# EAGLE design Power_Block (EAGLE 5.06)
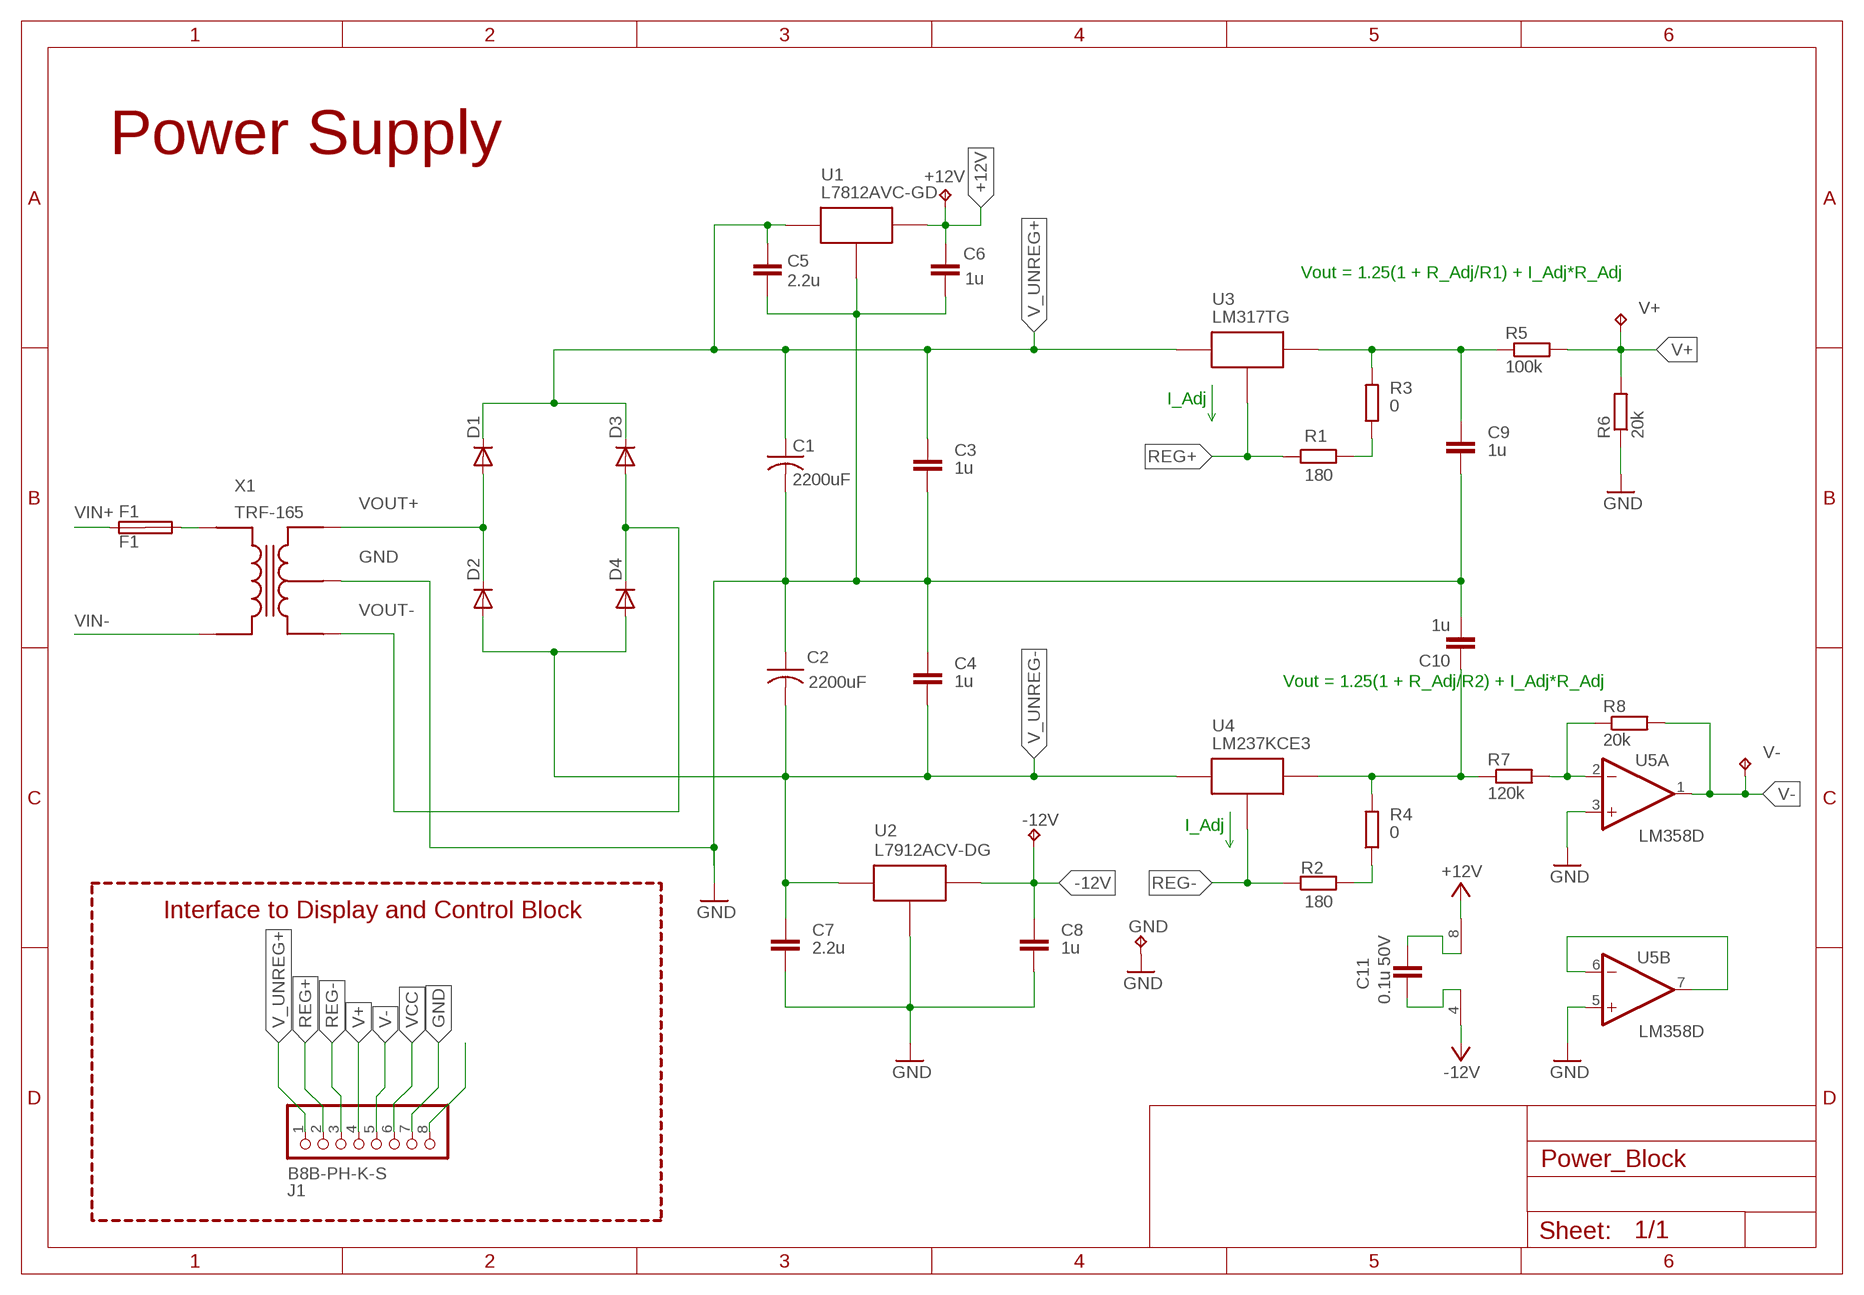
[diagram p0: schematic, sheet 1]

## Parts
+12V  TPTP20SQ  [TP20SQ]
-12V  TPTP20SQ  [TP20SQ]
C1  2200uF  ESK228M  [ESK228M]
C2  2200uF  ESK228M  [ESK228M]
C3  1u  C-EU025-024X044  [C025-024X044]
C4  1u  C-EU025-024X044  [C025-024X044]
C5  2.2u  C-EU025-024X044  [C025-024X044]
C6  1u  C-EU025-024X044  [C025-024X044]
C7  2.2u  C-EU025-024X044  [C025-024X044]
C8  1u  C-EU025-024X044  [C025-024X044]
C9  1u  C-EU025-024X044  [C025-024X044]
C10  1u  C-EU025-024X044  [C025-024X044]
C11  0.1u 50V  C-EU025-024X044  [C025-024X044]
D1  VS-2EFH02HM3/I  [DO-219AB]
D2  VS-2EFH02HM3/I  [DO-219AB]
D3  VS-2EFH02HM3/I  [DO-219AB]
D4  VS-2EFH02HM3/I  [DO-219AB]
F1  F1  SHK20L  [SHK20L]
GND  TPTP20SQ  [TP20SQ]
J1  B8B-PH-K-S  [B8B-PH-K-S]
R1  180  R-EU_R0603  [R0603]
R2  180  R-EU_R0603  [R0603]
R3  0  R-EU_R0603  [R0603]
R4  0  R-EU_R0603  [R0603]
R5  100k  R-EU_R0603  [R0603]
R6  20k  R-EU_R0603  [R0603]
R7  120k  R-EU_R0603  [R0603]
R8  20k  R-EU_R0603  [R0603]
U1  L7812AVC-GD  [T0-220]
U2  L7912ACV-DG  [T0-220]
U3  LM317TG  [T0-220]
U4  LM237KCE3  [T0-220]
U5  LM358D  [SO08]
V+  TPTP20SQ  [TP20SQ]
V-  TPTP20SQ  [TP20SQ]
X1  TRF-165  [TRF-165]

## Nets
+12V: +12V.TP C6.2 C11.2 U1.P3 U5.8(P:V+) ; supply symbol labelled VCC
-12V: -12V.TP C8.2 C11.1 U2.P3 U5.4(P:V-) ; supply symbol labelled VCC
GND: C1.LL- C2.LL+ C3.1 C4.2 C5.1 C6.1 C7.1 C8.1 C9.1 C10.2 GND.TP J1.7 R6.1 U1.P2 U2.P1 U5.3(A:+IN) U5.5(B:+IN) X1.GND
N$5: U5.6(B:-IN) U5.7(B:OUT)
N$8: C10.1 R4.2 R7.1 U4.P3
N$11: J1.8
N$15: R2.2 R4.1
N$16: R7.2 R8.1 U5.2(A:-IN)
N$17: R1.2 R3.1
N$20: F1.2A X1.VIN1
REG+: J1.2 R1.1 U3.P1
REG-: J1.3 R2.1 U4.P1
V+: J1.4 R5.2 R6.2 V+.TP
V-: J1.5 R8.2 U5.1(A:OUT) V-.TP
V_POS_REG: C9.2 R3.2 R5.1 U3.P2
V_UNREG+: C1.LL+ C3.2 C5.2 D1.C D3.C J1.1 U1.P1 U3.P3
V_UNREG-: C2.LL- C4.1 C7.2 D2.A D4.A U2.P2 U4.P2
VCC: J1.6
VIN+: F1.1A
VIN-: X1.VIN2
VOUT+: D1.A D2.C X1.VOUT+
VOUT-: D3.A D4.C X1.VOUT-
Unconnected: F1.1B F1.2B

## Notes on the sheet
- Power Supply
- Vout = 1.25(1 + R_Adj/R1) + I_Adj*R_Adj
- I_Adj
- Vout = 1.25(1 + R_Adj/R2) + I_Adj*R_Adj
- I_Adj
- Interface to Display and Control Block

## Library data of the parts
+12V -12V GND V+ V- = testpad:TP: Test pad
C1 C2 = VladimirG:ESK228M
C3-C11 = rcl:C-EU: CAPACITOR, European symbol
D1-D4 = VladimirG:VS-2EFH02HM3/I
F1 = fuse:SHK20L: FUSE HOLDER 5 x 20 mm, SH contact, SHH1 Schukat, E1073 Buerklin
J1 = VladimirG:B8B-PH-K-S: CONN HEADER VERT 8POS 2MM
R1-R8 = rcl:R-EU_: RESISTOR, European symbol
U1 = VladimirG:L7812AVC-GD: IC REG LINEAR 12V 1.5A TO220AB
U2 = VladimirG:L7912ACV-DG
U3 = VladimirG:LM317TG
U4 = VladimirG:LM237KCE3
U5 = linear:LM358: OP AMP also LM158; LM258; LM2904 Source: http://cache.national.com/ds/LM/LM158.pdf
X1 = VladimirG:TRF-165

## Board
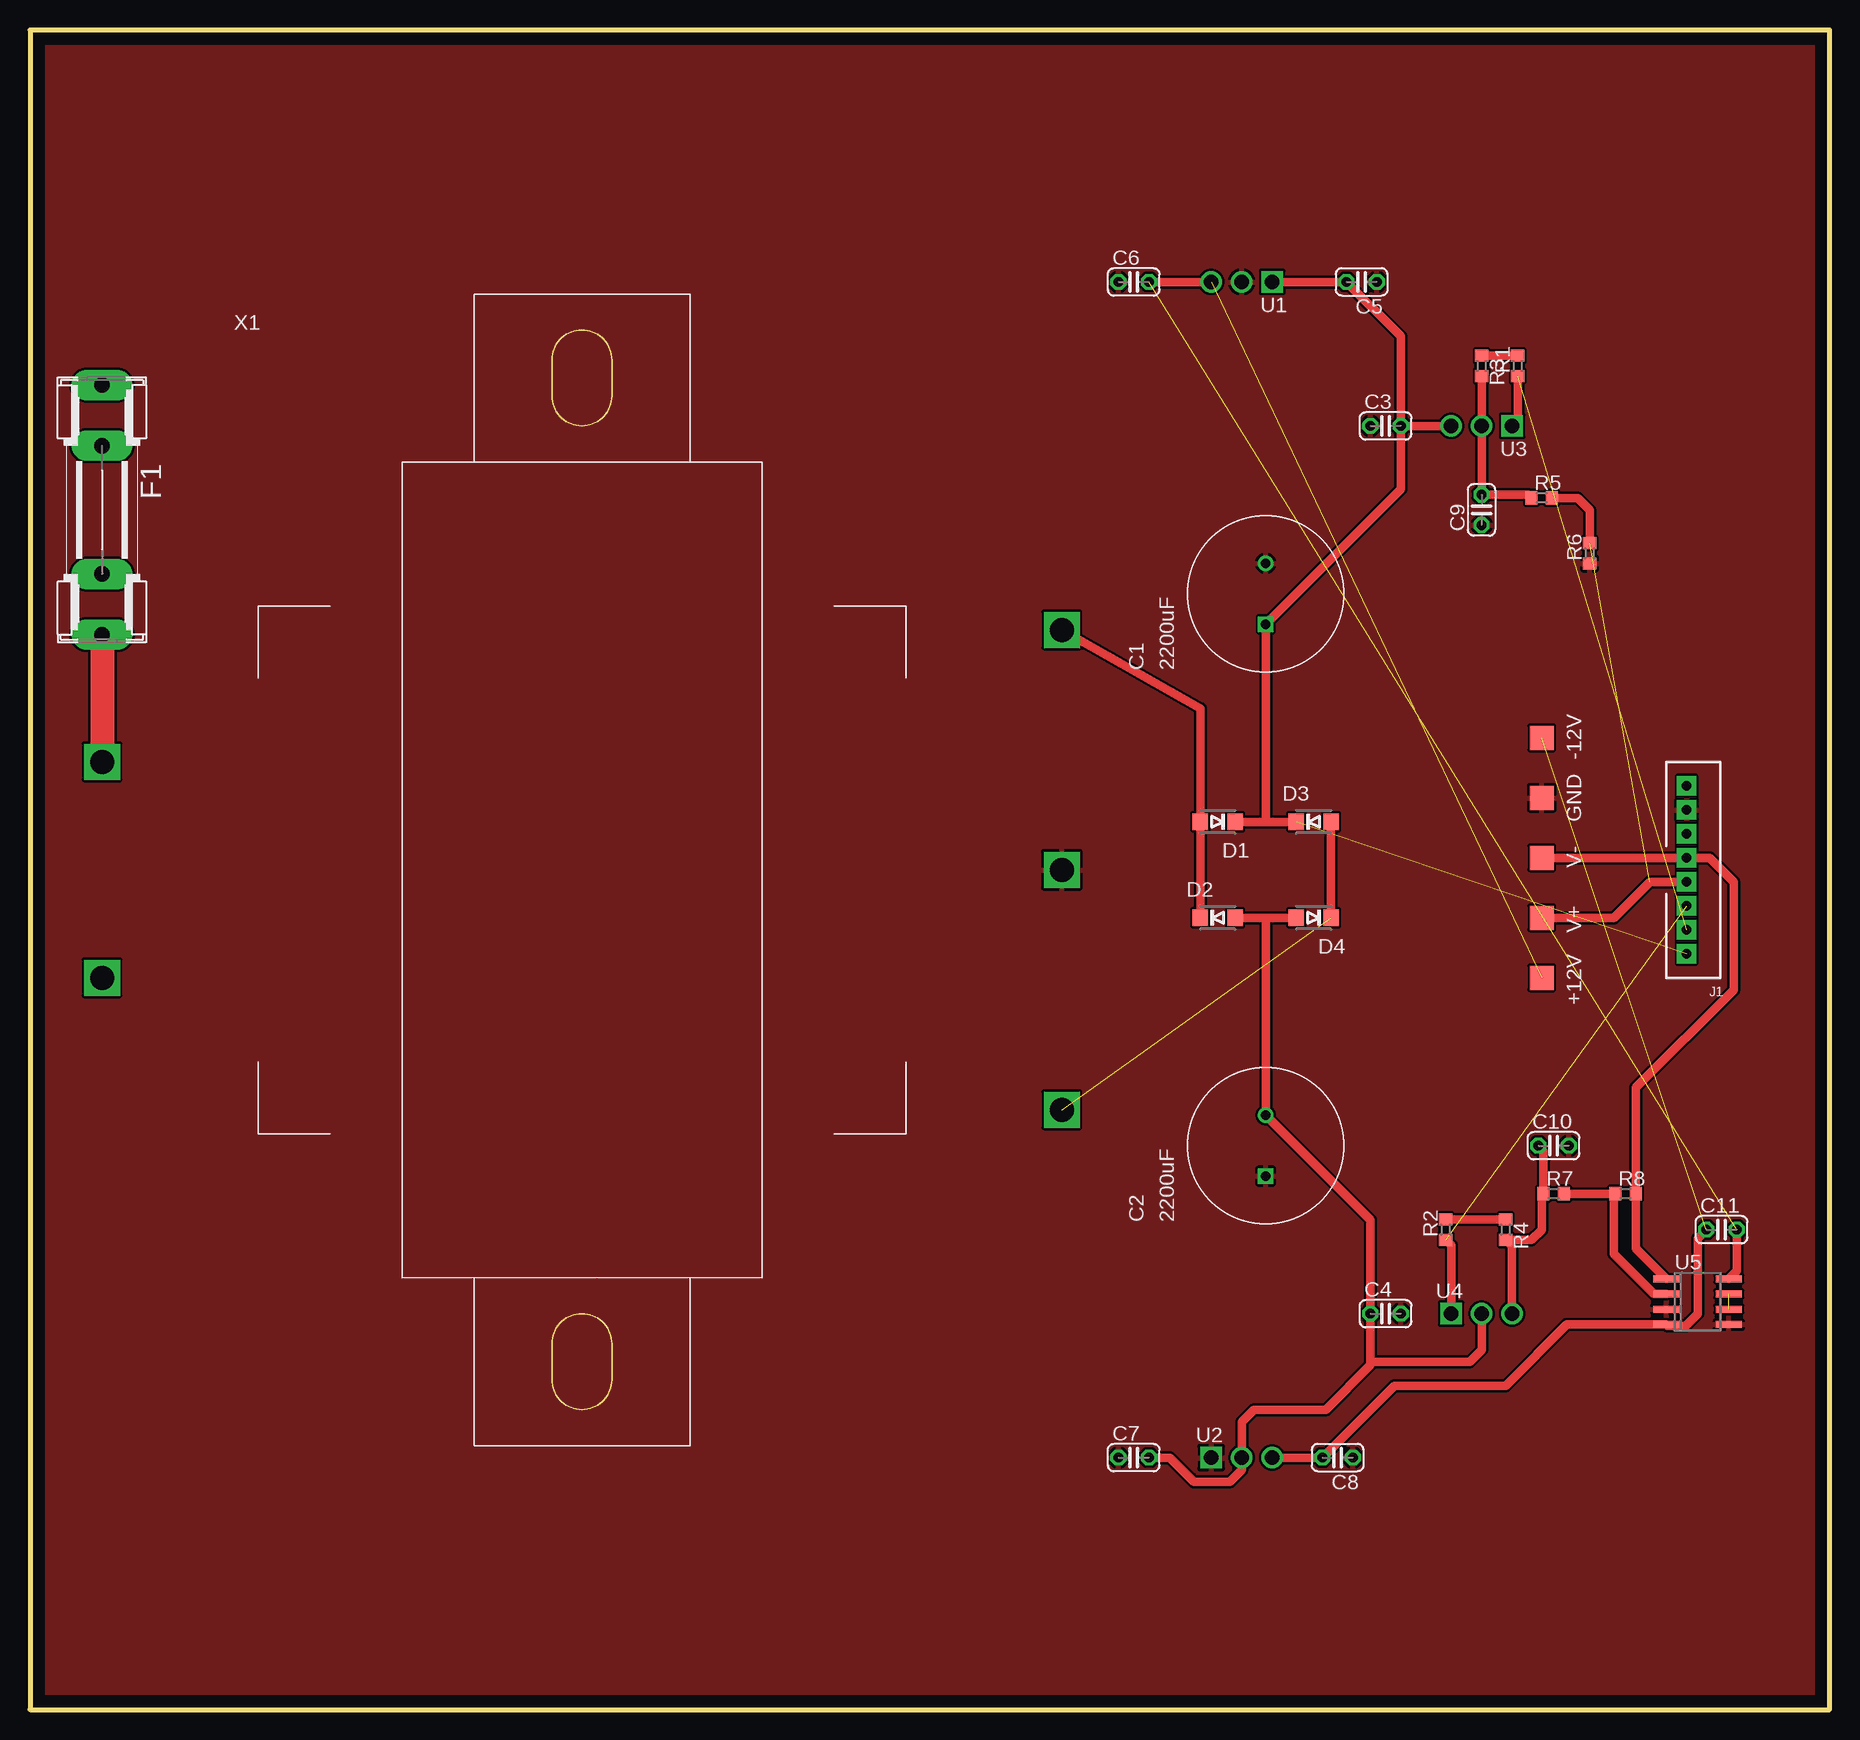
[diagram p1: board, top side]
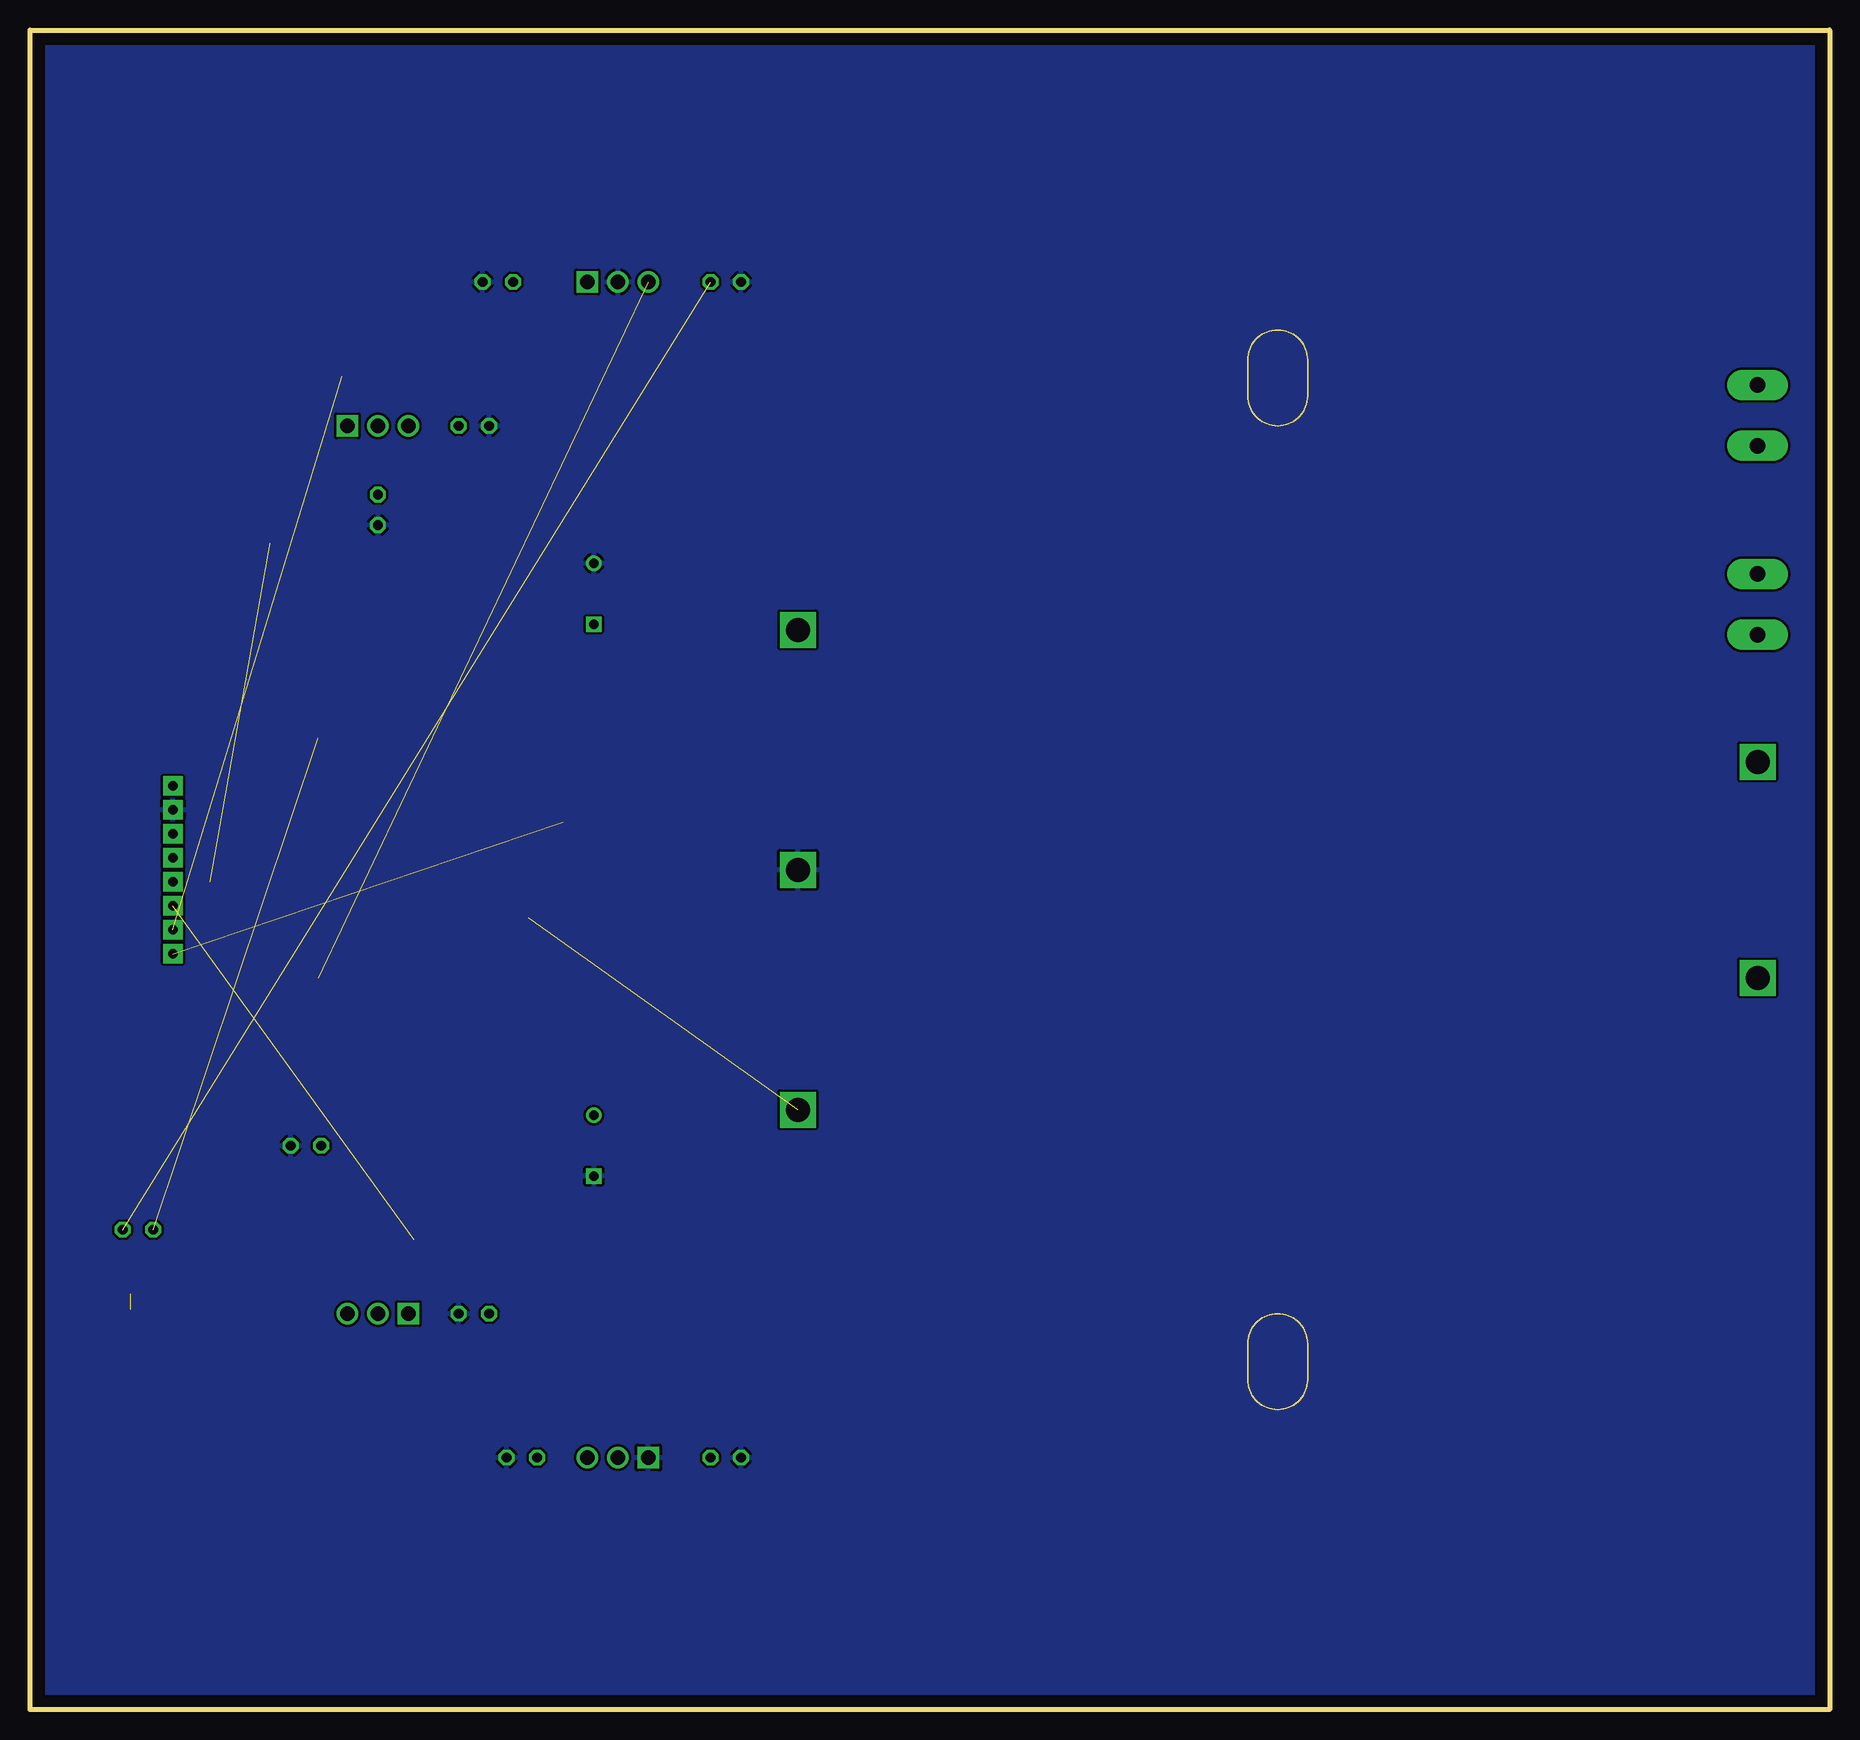
[diagram p2: board, bottom side, seen from below]

Size 150 x 140 mm. Coordinates in mm from the lower left corner, seen from the top.
Outline: 0,0 150,0 150,140 0,140 0,0
Copper layers (1*16): Top 0.035mm / dielectric 1.5mm / Bottom 0.035mm
Design rules "default": minimum track width 10mil, minimum drill 24mil, track to track 8mil, track to pad 8mil, pad to pad 8mil, via to via 8mil, smd to smd 8mil, copper to edge 40mil, drill to drill 8mil, minimum pad ring 10mil, minimum via ring 8mil, stop-mask expansion 4mil, vias tented up to drill 0mil, thermal gap 10mil

### Footprints (pad centres in the part's own frame; a part is rotated, then mirrored left to right if it is on the bottom)
TP20SQ = smd 2 x 2: TP 0,0
ESK228M = drill 0.762 square: LL+ -2.54,0 | drill 0.762 round: LL- 2.54,0
C025-024X044 = drill 0.813 octagon: 1 -1.27,0; 2 1.27,0
DO-219AB = smd 1.295 x 1.397: A -1.448,0; C 1.448,0
SHK20L = drill 1.321 pad 2.54 long: 1A -10.414,0; 1B -5.334,0; 2A 10.414,0; 2B 5.334,0
B8B-PH-K-S = drill 0.8 pad 1.6 square: 1 -0.085,7; 2 -0.085,5; 3 -0.085,3; 4 -0.085,1; 5 -0.085,-1; 6 -0.085,-3; 7 -0.085,-5; 8 -0.085,-7
R0603 = smd 1 x 1.1: 1 -0.85,0; 2 0.85,0
T0-220 = drill 1.2 pad 1.7 square: P1 -2.54,0 | drill 1.2 pad 1.7 round: P2 0,0; P3 2.54,0
SO08 = smd 0.6 x 2.2: 1 -1.905,-2.6; 2 -0.635,-2.6; 3 0.635,-2.6; 4 1.905,-2.6; 5 1.905,2.6; 6 0.635,2.6; 7 -0.635,2.6; 8 -1.905,2.6
TRF-165 = drill 2 square: GND 40,0; VIN1 -40,9; VIN2 -40,-9; VOUT+ 40,20; VOUT- 40,-20

### Placement (x,y rotation side)
+12V  126,61 270 top
-12V  126,81 270 top
C1  103,93 90 top
C2  103,47 90 top
C3  113,107 0 top
C4  113,33 0 top
C5  111,119 180 top
C6  92,119 0 top
C7  92,21 0 top
C8  109,21 180 top
C9  121,100 90 top
C10  127,47 0 top
C11  141,40 0 top
D1  99,74 0 top
D2  99,66 180 top
D3  107,74 180 top
D4  107,66 0 top
F1  6,100 270 top
GND  126,76 270 top
J1  138,70 180 top
R1  124,112 90 top
R2  118,40 90 top
R3  121,112 270 top
R4  123,40 270 top
R5  126,101 0 top
R6  130,96.38 90 top
R7  127,43 0 top
R8  133,43 0 top
U1  101,119 180 top
U2  101,21 0 top
U3  121,107 180 top
U4  121,33 0 top
U5  139,34 270 top
V+  126,66 270 top
V-  126,71 270 top
X1  46,70 0 top

### Tracks (layer width: path | path; a pad name or v marks a point on that pad's centre or on a via)
+12V  (2 unrouted)
  Top 0.7: C6.2 U1.P3 | U5.8 142.27,36.58 C11.2
-12V  (1 unrouted)
  Top 0.7: U2.P3 C8.2 113.73,27 123,27 128.09,32.09 U5.4 136.5,32 138,32 139,33 139,39.27 C11.1
GND
  pour Top: -1,-1 -1,141 151,141 151,-1
  pour Bottom: -2,-2 -2,142 152,142 152,-2
N$5  (1 unrouted)
N$8
  Top 0.7: U4.P3 123.54,38.61 R4.2 125.15,39.15 126,40 126,42.85 R7.1 126.15,46.58 C10.1
N$15
  Top 0.7: R2.2 R4.1
N$16
  Top 0.7: R7.2 R8.1 132,42.85 132,38 135.37,34.63 U5.2
N$17
  Top 0.7: R1.2 R3.1
N$20
  Top 2: F1.2A X1.VIN1
REG+  (1 unrouted)
  Top 0.7: U3.P1 124,107.46 R1.1
REG-  (1 unrouted)
  Top 0.7: R2.1 118.46,38.69 U4.P1
V+  (1 unrouted)
  Top 0.7: R5.2 129,101 130,100 R6.2 | J1.4 135,69 132,66 V+.TP
V-
  Top 0.7: V-.TP J1.5 140,71 142,69 142,60 133.85,51.85 R8.2 133.85,38.45 U5.1
V_POS_REG
  Top 0.7: U3.P2 R3.2 C9.2 124.88,101.27 R5.1
V_UNREG+  (1 unrouted)
  Top 0.7: D1.C 103,74 | 103,74 D3.C | 103,74 C1.LL+ 114.27,101.73 C3.2 | U1.P1 C5.2 114.27,114.46 C3.2 | C3.2 U3.P3
V_UNREG-
  Top 0.7: 103,66 D2.A 101,66 | 103,66 D4.A | 103,66 C2.LL- 111.73,40.81 C4.1 111.73,29 | C7.2 95,21 97,19 100,19 101,20 U2.P2 101,24 102,25 108,25 111.73,28.73 111.73,29 | U4.P2 121,30 120,29 111.73,29
VOUT+
  Top 0.7: X1.VOUT+ 97.55,83.45 D1.A D2.C
VOUT-  (1 unrouted)
  Top 0.7: D4.C D3.A